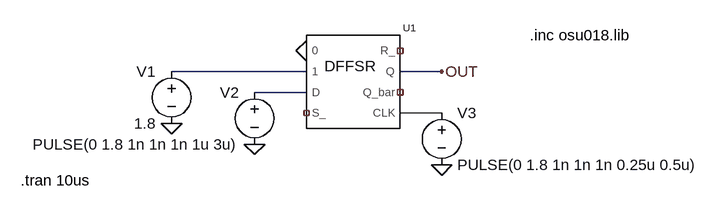
[diagram p0: schematic D_FFtest.asc]
D_FFtest.asc, the LTspice schematic file:
Version 4
SHEET 1 880 680
WIRE 96 128 -112 128
WIRE 304 128 240 128
WIRE 96 160 16 160
WIRE 304 192 240 192
FLAG 304 128 OUT
FLAG 96 96 0
FLAG 16 240 0
FLAG -112 208 0
FLAG 304 272 0
SYMBOL DFFSR_Qbar 160 144 R0
SYMATTR InstName U1
SYMBOL voltage -112 112 M0
WINDOW 123 0 0 Left 0
WINDOW 39 0 0 Left 0
SYMATTR InstName V1
SYMATTR Value 1.8
SYMBOL voltage 16 144 M0
WINDOW 123 0 0 Left 0
WINDOW 39 0 0 Left 0
SYMATTR InstName V2
SYMATTR Value PULSE(0 1.8 1n 1n 1n 1u 3u)
SYMBOL voltage 304 176 R0
WINDOW 123 0 0 Left 0
WINDOW 39 0 0 Left 0
SYMATTR InstName V3
SYMATTR Value PULSE(0 1.8 1n 1n 1n 0.25u 0.5u)
TEXT 440 72 Left 2 !.inc osu018.lib
TEXT -344 296 Left 2 !.tran 10us

The netlist it stands for:
* D_FFtest.asc
XU1 0 N001 N002 NC_01 NC_02 OUT NC_03 N003 DFFSR  ; pins 0 1 D S_ R_ Q Q_bar CLK
V1 N001 0 1.8
V2 N002 0 PULSE(0 1.8 1n 1n 1n 1u 3u)
V3 N003 0 PULSE(0 1.8 1n 1n 1n 0.25u 0.5u)
.inc osu018.lib
.tran 10us
.lib C:\Users\ananya\Documents\LTspiceXVII\active_high_with_qbar.cir
.backanno
.end